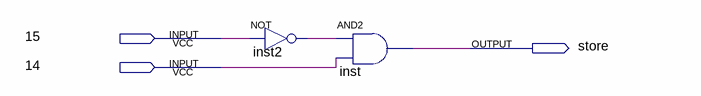
[diagram p0: schematic sheet]
// Quartus schematic comcheck-store.bdf as structural Verilog: 2 symbols, 3 pins
module \comcheck-store  (
  input  \15 ,
  input  \14 ,
  output store
);

  wire inst2_out;

  not inst2 (inst2_out, \15 );
  and inst (store, inst2_out, \14 );
endmodule
